# Altium schematic sheet USB-NORA-W1_TOP_01.SchDoc: PCB-USB-NORA-W1
size B; Date: 09/17/2021; CompanyName: U-Blox; DrawnBy: ASOH/HEKF; Engineer: ASOH/HEKF; Organization: U-Blox; Address1: Östra Varvsgatan 4; Address2: SE-211 75 Malmo; DocumentNumber: 1; SheetNumber: 1; SheetTotal: 3; SheetSize: B; SheetTitle: TopSheet
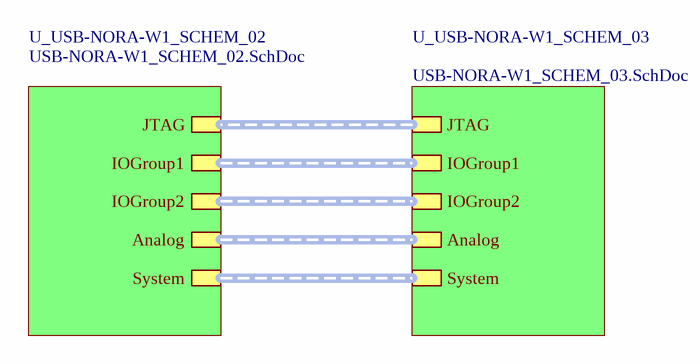
[diagram p0: USB-NORA-W1_TOP_01.SchDoc]

## Parts
(Parts that share a designator on the sheet are numbered #1, #2 ... from top to bottom, then left to right.)
?#1  (no value)  (graphical)
?#2  (no value)  (graphical)

## Sub-sheets
U_USB-NORA-W1_SCHEM_02 = USB-NORA-W1_SCHEM_02.SchDoc: Analog (harness Analog), System (harness System), JTAG (harness JTAG), IOGroup1 (harness IOGroup1), IOGroup2 (harness IOGroup2)
U_USB-NORA-W1_SCHEM_03 = USB-NORA-W1_SCHEM_03.SchDoc: System (harness System), Analog (harness Analog), JTAG (harness JTAG), IOGroup1 (harness IOGroup1), IOGroup2 (harness IOGroup2)

## Buses and harness runs
harness sheet U_USB-NORA-W1_SCHEM_02/Analog = sheet U_USB-NORA-W1_SCHEM_03/Analog
harness sheet U_USB-NORA-W1_SCHEM_02/IOGroup1 = sheet U_USB-NORA-W1_SCHEM_03/IOGroup1
harness sheet U_USB-NORA-W1_SCHEM_02/IOGroup2 = sheet U_USB-NORA-W1_SCHEM_03/IOGroup2
harness sheet U_USB-NORA-W1_SCHEM_02/JTAG = sheet U_USB-NORA-W1_SCHEM_03/JTAG
harness sheet U_USB-NORA-W1_SCHEM_02/System = sheet U_USB-NORA-W1_SCHEM_03/System

## Notes on the sheet
- Rev.
- Description
- Revision
- Date
- By
- Prepared By
- Revision:
- CONFIDENTIAL
- Page:

## Library data of the parts
?#1 = Top_Revision_Block: Release Revision History Block
?#2 = Top_Title_Block: Top level schematic title block for top level sheet